# Altium schematic sheet PWR_LDOs.SchDoc: Power LDOs
size 420 x 297 mm; Author: P. Zdunek; DrawnBy: P. Zdunek; DocumentNumber: 31; SheetNumber: 31; SheetTotal: 37; ModifiedBy: -; CheckedDate: -; Title2: Fast Stabilizer; DivGrp: WUT ISE; Designer: G.Kasprowicz
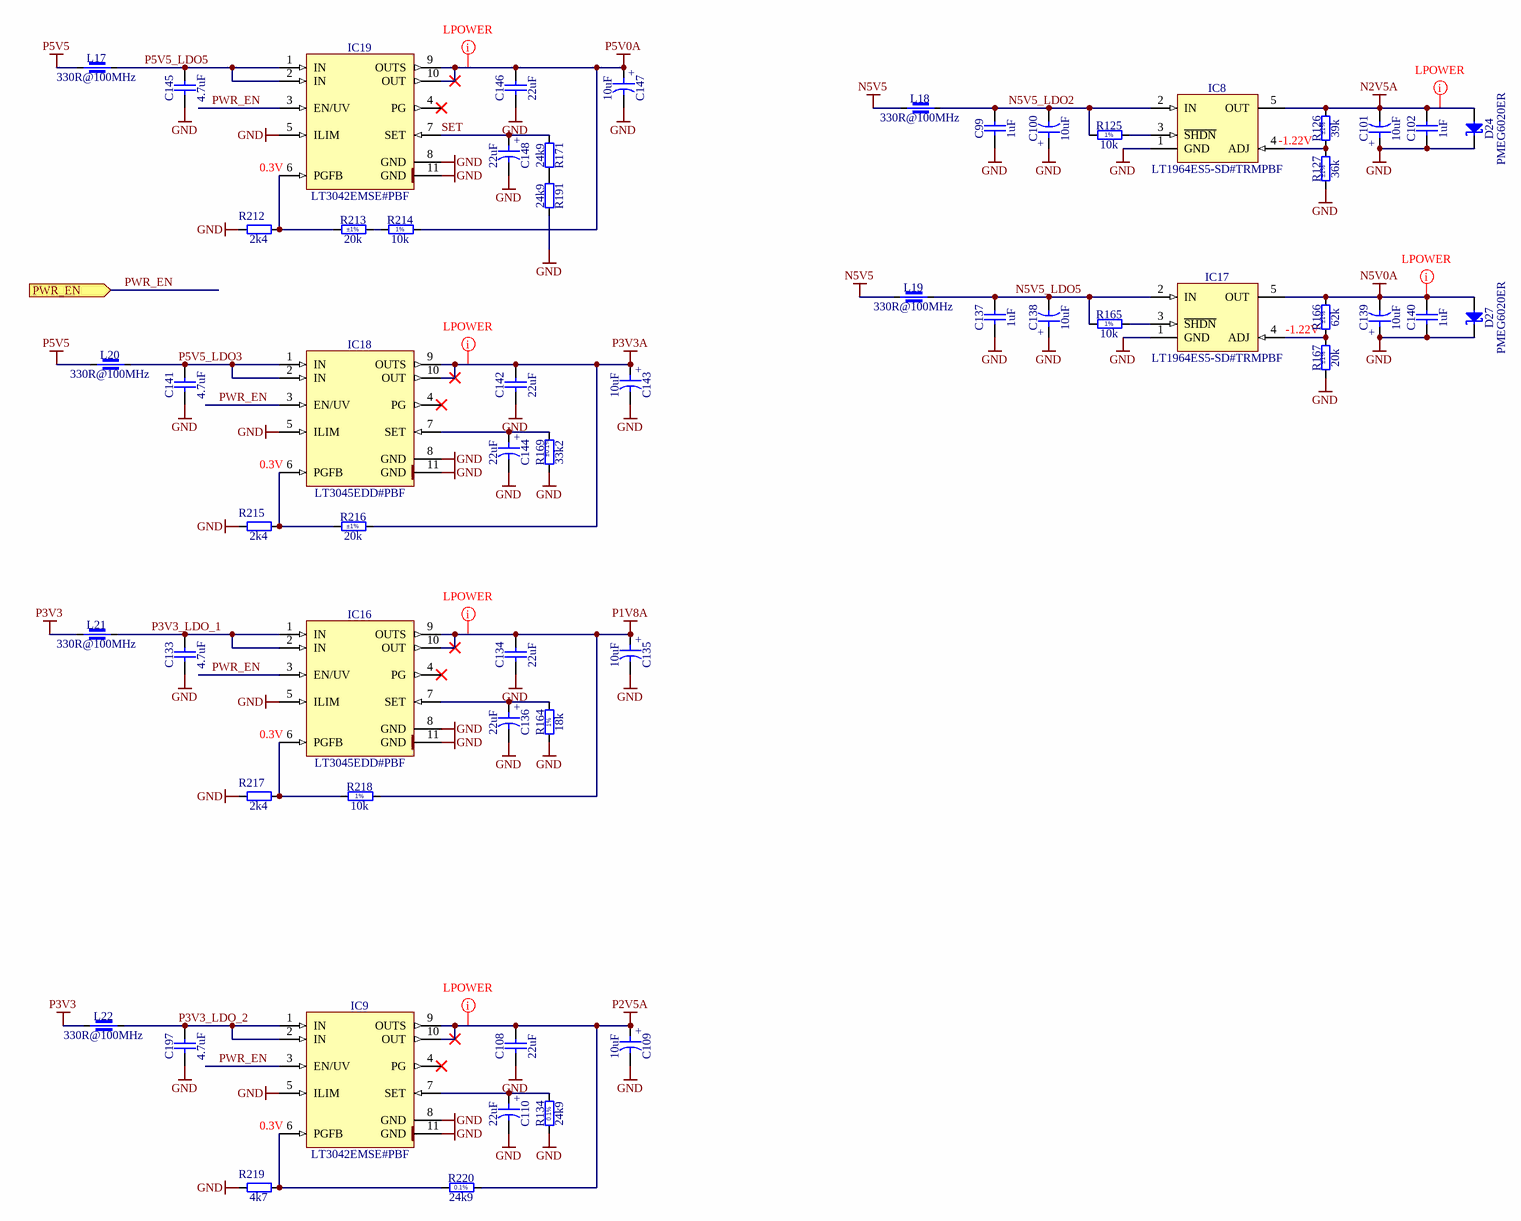
[diagram p0: PWR_LDOs.SchDoc]

## Parts
C99  1uF  [CAPC1005X55N]
C100  10uF  [CAPMP3216X180N]
C101  10uF  [CAPMP3216X180N]
C102  1uF  [CAPC1005X55N]
C108  22uF  [CAPC2012X135N]
C109  10uF  [CAPMP3216X180N]
C110  22uF  [CAPMP3216X180N]
C133  4.7uF  [CAPC1709X95N]
C134  22uF  [CAPC2012X135N]
C135  10uF  [CAPMP3216X180N]
C136  22uF  [CAPMP3216X180N]
C137  1uF  [CAPC1005X55N]
C138  10uF  [CAPMP3216X180N]
C139  10uF  [CAPMP3216X180N]
C140  1uF  [CAPC1005X55N]
C141  4.7uF  [CAPC1709X95N]
C142  22uF  [CAPC2012X135N]
C143  10uF  [CAPMP3216X180N]
C144  22uF  [CAPMP3216X180N]
C145  4.7uF  [CAPC1709X95N]
C146  22uF  [CAPC2012X135N]
C147  10uF  [CAPMP3216X180N]
C148  22uF  [CAPMP3216X180N]
C197  4.7uF  [CAPC1709X95N]
D24  PMEG6020ER  [SODFL3517X110N]
D27  PMEG6020ER  [SODFL3517X110N]
IC8  LT1964ES5-SD#TRMPBF  [SOT95P280X100-5N]
IC9  LT3042EMSE#PBF  [SOP50P490X110-11N-R168X198]
IC16  LT3045EDD#PBF  [SON50P300X300X80-11N-R175X248]
IC17  LT1964ES5-SD#TRMPBF  [SOT95P280X100-5N]
IC18  LT3045EDD#PBF  [SON50P300X300X80-11N-R175X248]
IC19  LT3042EMSE#PBF  [SOP50P490X110-11N-R168X198]
L17  330R@100MHz  [INDC1608X75N]
L18  330R@100MHz  [INDC1608X75N]
L19  330R@100MHz  [INDC1608X75N]
L20  330R@100MHz  [INDC1608X75N]
L21  330R@100MHz  [INDC1608X75N]
L22  330R@100MHz  [INDC1608X75N]
R125  10k  [RESC1005X40N]
R126  39k  Tolerance: ±1%  [RESC1005X40N]
R127  36k  Tolerance: ±1%  [RESC1005X40N]
R134  24k9  [RESC1608X55N]
R164  18k  [RESC1608X55N]
R165  10k  [RESC1005X40N]
R166  62k  Tolerance: ±1%  [RESC1005X40N]
R167  20k  Tolerance: ±1%  [RESC1005X40N]
R169  33k2  Tolerance: ±0.1%  [RESC1608X55N]
R171  24k9  [RESC1608X55N]
R191  24k9  [RESC1608X55N]
R212  2k4  [RESC1005X40N]
R213  20k  Tolerance: ±1%  [RESC1005X40N]
R214  10k  [RESC1005X40N]
R215  2k4  [RESC1005X40N]
R216  20k  Tolerance: ±1%  [RESC1005X40N]
R217  2k4  [RESC1005X40N]
R218  10k  [RESC1005X40N]
R219  4k7  [RESC1005X40N]
R220  24k9  [RESC1608X55N]

## Ports
PWR_EN (in)

## Nets
GND: C99.1 C100.1 C101.1 C102.1 C108.1 C109.2 C110.2 C133.1 C134.1 C135.2 C136.2 C137.1 C138.1 C139.1 C140.1 C141.1 C142.1 C143.2 C144.2 C145.1 C146.1 C147.2 C148.2 C197.1 D24.1(C) D27.1(C) IC8.1(GND) IC9.5(ILIM) IC9.8(GND) IC9.11(GND) IC16.5(ILIM) IC16.8(GND) IC16.11(GND) IC17.1(GND) IC18.5(ILIM) IC18.8(GND) IC18.11(GND) IC19.5(ILIM) IC19.8(GND) IC19.11(GND) R127.1 R134.1 R164.1 R167.1 R169.1 R191.2 R212.1 R215.1 R217.1 R219.1
N2V5A: C101.2 C102.2 D24.2(A) IC8.5(OUT) R126.2
N5V0A: C139.2 C140.2 D27.2(A) IC17.5(OUT) R166.2
N5V5: L18.1 L19.1
P1V8A: C134.2 C135.1 IC16.9(OUTS) IC16.10(OUT) R218.2
P2V5A: C108.2 C109.1 IC9.9(OUTS) IC9.10(OUT) R220.2
P3V3: L21.1 L22.1
P3V3A: C142.2 C143.1 IC18.9(OUTS) IC18.10(OUT) R216.2
P5V0A: C146.2 C147.1 IC19.9(OUTS) IC19.10(OUT) R214.2
P5V5: L17.1 L20.1
N5V5_LDO2: C99.2 C100.2 IC8.2(IN) L18.2 R125.1
N5V5_LDO5: C137.2 C138.2 IC17.2(IN) L19.2 R165.1
P3V3_LDO_1: C133.2 IC16.1(IN) IC16.2(IN) L21.2
P3V3_LDO_2: C197.2 IC9.1(IN) IC9.2(IN) L22.2
P5V5_LDO3: C141.2 IC18.1(IN) IC18.2(IN) L20.2
P5V5_LDO5: C145.2 IC19.1(IN) IC19.2(IN) L17.2
PWR_EN: IC9.3(EN/UV) IC16.3(EN/UV) IC18.3(EN/UV) IC19.3(EN/UV) ; port PWR_EN
SET: C148.1 IC19.7(SET) R171.1
NetC110_1: C110.1 IC9.7(SET) R134.2
NetC136_1: C136.1 IC16.7(SET) R164.2
NetC144_1: C144.1 IC18.7(SET) R169.2
NetIC8_3: IC8.3(~{SHDN}) R125.2
NetIC8_4: IC8.4(ADJ) R126.1 R127.2
NetIC9_6: IC9.6(PGFB) R219.2 R220.1
NetIC16_6: IC16.6(PGFB) R217.2 R218.1
NetIC17_3: IC17.3(~{SHDN}) R165.2
NetIC17_4: IC17.4(ADJ) R166.1 R167.2
NetIC18_6: IC18.6(PGFB) R215.2 R216.1
NetIC19_6: IC19.6(PGFB) R212.2 R213.1
NetR171_2: R171.2 R191.1
NetR213_2: R213.2 R214.1

Not connected (* = marked no-connect by the designer): IC9 4(PG)*; IC16 4(PG)*; IC18 4(PG)*; IC19 4(PG)*

## Layout directives
net class Lpower: N2V5A, N5V0A, P1V8A, P2V5A, P3V3A, P5V0A

## Notes on the sheet
- -1.22V
- (near IC19) 0.3V
- (near IC18) 0.3V
- (near IC16) 0.3V
- (near IC9) 0.3V
- Project/Equipment
- Document
- Designer
- Drawn by
- Check.by
- Copyright WUT ISE 2020.
  This documentation describes Open Hardware and is licensed under the CERN OHL v.1.2. You may redistribute and modify this documentation under the terms of the CERN OHL v.1.2. (http://ohwr.org/CERNOHL). This documentation is distributed WITHOUT ANY EXPRESS OR IMPLIED WARRANTY, INCLUDING OF MERCHANTABILITY, SATISFACTORY QUALITY AND FITNESS FOR A PARTICULAR PURPOSE. Please see the CERN OHL v.1.2 for applicable conditions.
- Contact
- File
- Last Mod.
- Print Date
- Sheet
- Size
- A3
- of
- Rev
- (in symbol CTE3216-18_10UF_16V_20%_AVX_TCJ) +
- (in symbol CTE3216-18_22UF_10V_10%) +
- (in symbol R0402_10K_1%_0.0625W_100PPM) 1%
- (in symbol R0603_18K_1%_0.1W_100PPM) 1%
- (in symbol R0603_24K9_0.1%_0.063W_10PPM) 0.1%

## Library data of the parts
C99 C102 C137 C140 = CC0402_1UF_16V_10%_X5R: Non-polarised capacitor; Part Description: SMD Multilayer Chip Ceramic Capacitor; Manufacturer: GENERIC; Manufacturer1 Part Number: C1005X5R1C105KT; Voltage: 16V; TC: X5R; Tolerance: ±10%; Part Number: CC0402_1UF_16V_10%_X5R; Component Kind: Standard; Component Type: Standard; Pin Count: 2; Value: 1uF; Status: Preferred; Manufacturer Part Number: CC0402_1UF_16V_10%_X5R; Case: 0402; Mounted: Yes; Socket: No; SMD: Yes; Sense: No; Manufacturer1 Example: TDK; Manufacturer1 ComponentHeight: 0.55mm; HelpURL: \\cern.ch\dfs\Applications\Altium\Datasheets\CC0402_X5R_TDK_C.pdf; Author: CERN DEM JLC; CreateDate: 25/10/2012; LatestRevisionDate: 25/10/2012
C100 C101 C109 C135 C138 C139 C143 C147 = CTE3216-18_10UF_16V_20%_AVX_TCJ: Polarised capacitor; Part Description: ESR 0R200 Tantalum Solid Electrolytic Chip Capacitor with Conductive Polymer Electrode; Manufacturer: AVX; Manufacturer Part Number: TCJA106M016R0200; Voltage: 16V; Tolerance: ±20%; Part Number: CTE3216-18_10UF_16V_20%_AVX_TCJ; Component Kind: Standard; Component Type: Standard; Pin Count: 2; Value: 10uF; Status: Preferred; Case: A; Mounted: Yes; Socket: No; SMD: Yes; Sense: No; ComponentHeight: 1.8mm; HelpURL: \\cern.ch\dfs\Applications\Altium\Datasheets\CTE_AVX_TCJ.pdf; Author: CERN DEM JLC; CreateDate: 29.03.2012; LatestRevisionDate: 29.03.2012
C108 C134 C142 C146 = CC0805_22UF_16V_10%_X5R: Non-polarised capacitor; Part Description: SMD Multilayer Chip Ceramic Capacitor; Manufacturer: GENERIC; Manufacturer1 Part Number: C2012X5R1C226KT; Voltage: 16V; TC: X5R; Tolerance: ±10%; Part Number: CC0805_22UF_16V_10%_X5R; Component Kind: Standard; Component Type: Standard; Pin Count: 2; Value: 22uF; Status: Preferred; Manufacturer Part Number: CC0805_22UF_16V_10%_X5R; Case: 0805; Mounted: Yes; Socket: No; SMD: Yes; Sense: No; Manufacturer1 Example: TDK; Manufacturer1 ComponentHeight: 1.35mm; HelpURL: \\cern.ch\dfs\Applications\Altium\Datasheets\CC0805_X5R_TDK_C.pdf; Author: CERN DEM JLC; CreateDate: 25.10.2012; LatestRevisionDate: 25.10.2012
C110 C136 C144 C148 = CTE3216-18_22UF_10V_10%: Polarised capacitor; Part Description: Solid Tantalum Chip Capacitor; Manufacturer: GENERIC; Manufacturer1 Part Number: TAJA226K010R; Voltage: 10V; Tolerance: ±10%; Part Number: CTE3216-18_22UF_10V_10%; Component Kind: Standard; Component Type: Standard; Pin Count: 2; Value: 22uF; Status: Preferred; Manufacturer Part Number: CTE3216-18_22UF_10V_10%; Case: A; Mounted: Yes; Socket: No; SMD: Yes; Sense: No; Manufacturer1 Example: AVX; Manufacturer1 ComponentHeight: 1.8mm; HelpURL: \\cern.ch\dfs\Applications\Altium\Datasheets\CTE_AVX_TAJ.pdf; Author: CERN DEM JLC; CreateDate: 03/12/2007; LatestRevisionDate: 03/12/2007
C133 C141 C145 C197 = CC0603_4.7UF_16V_10%_X5R: Non-polarised capacitor; Part Description: SMD Multilayer Chip Ceramic Capacitor; Manufacturer: GENERIC; Manufacturer1 Part Number: EMK107ABJ475KA-T; Voltage: 16V; TC: X5R; Tolerance: ±10%; Part Number: CC0603_4.7UF_16V_10%_X5R; Component Kind: Standard; Component Type: Standard; Pin Count: 2; Value: 4.7uF; Status: None; Manufacturer Part Number: CC0603_4.7UF_16V_10%_X5R; Case: 0603; Mounted: Yes; Socket: No; SMD: Yes; Sense: No; Manufacturer1 Example: TAIYO YUDEN; Manufacturer1 ComponentHeight: 0.95mm; HelpURL: \\cern.ch\dfs\Applications\Altium\Datasheets\CC0603_X7R_TAIYO-YUDEN_HIGH-VALUE.pdf; Author: CERN DEM JLC; CreateDate: 16-Dec-13; LatestRevisionDate: 16-Sep-14
D24 D27 = PMEG6020ER: Schottky Diode; Part Description: MEGA Schottky Barrier Rectifier; Manufacturer: NXP SEMICONDUCTORS; Voltage: 60V; Power: 2A; PressFit: No; Bonding: No; Part Number: PMEG6020ER; Component Kind: Standard; Component Type: Standard; Device: PMEG6020ER; PackageDescription: SODFL Diode (SOD123W); 2.60mm W X 1.70mm L X 1.10mm H body, IPC Medium Density; Manufacturer Part Number: PMEG6020ER; Pin Count: 2; Case: SOD-123FL; Mounted: Yes; Socket: No; SMD: Yes; Sense: No; ComponentHeight: 1.1mm; HelpURL: \\cern.ch\dfs\Applications\Altium\Datasheets\PMEG6020ER.pdf; Author: CERN DEM JMW; CreateDate: 19.06.2014; LatestRevisionDate: 19.06.2014
IC8 IC17 = LT1964ES5-SD#TRMPBF: 200mA, Low Noise, Low Dropout Negative Micropower Regulator; Part Description: -1.22V to -20V, 200mA, Low Noise, Low Dropout Negative Micropower Regulator; Manufacturer: LINEAR TECHNOLOGY; PressFit: No; Bonding: No; Part Number: LT1964ES5-SD#TRMPBF; Component Kind: Standard; Component Type: Standard; Device: LT1964ES5-SD#TRMPBF; PackageDescription: SOT23, 0.95mm pitch; 5 pin, 1.75mm W X 3.00mm L, IPC Medium Density; Manufacturer Part Number: LT1964ES5-SD#TRMPBF; Pin Count: 5; Case: SOT23-5; Mounted: Yes; Socket: No; SMD: Yes; Sense: No; ComponentHeight: 1mm; HelpURL: \\cern.ch\dfs\Applications\Altium\Datasheets\LT1964ES5-SD#TRMPBF.pdf; Author: CERN DEM JLC; CreateDate: 05.05.2009; LatestRevisionDate: 05.05.2009
IC9 IC19 = LT3042EMSE#PBF: 20V, 200mA, Ultralow Noise, Ultrahigh PSRR RF Linear Regulator; Manufacturer: LINEAR TECHNOLOGY; PressFit: No; Bonding: No; Part Number: LT3042EMSE#PBF; Component Kind: Standard; Component Type: Standard; Device: LT3042EMSE#PBF; PackageDescription: SOP, 0.50mm, Pitch; 10 pin, 3.00mm W X 3.00mm L X 1.10mm H body (w/thermal tab  1.68 X 1.98 mm), IPC Medium Density; Part Description: 20V, 200mA, Ultralow Noise, Ultrahigh PSRR RF Linear Regulator; Manufacturer Part Number: LT3042EMSE#PBF; Pin Count: 11; Case: MSOP10; Mounted: Yes; Socket: No; SMD: Yes; Sense: No; ComponentHeight: 1.1mm; HelpURL: \\cern.ch\dfs\Applications\Altium\Datasheets\LT3042EMSE#PBF.pdf; Author: CERN DEM MR; CreateDate: 09.06.2016; LatestRevisionDate: 09.06.2016
IC16 IC18 = LT3045EDD#PBF: 20V, 500mA, Ultralow Noise, Ultrahigh PSRR Linear Regulator; Manufacturer: LINEAR TECHNOLOGY; PressFit: No; Bonding: No; Part Number: LT3045EDD#PBF; Component Kind: Standard; Component Type: Standard; Device: LT3045EDD#PBF; PackageDescription: SON, 0.50mm Pitch; 10 Pin, 3.00mm W X 3.00mm L X 0.80mm H body (w/Thermal Tab 1.75 X 2.48 mm), IPC Medium Density; Part Description: 20V, 500mA, Ultralow Noise, Ultrahigh PSRR Linear Regulator; Manufacturer Part Number: LT3045EDD#PBF; Pin Count: 11; Case: SON10; Mounted: Yes; Socket: No; SMD: Yes; Sense: No; ComponentHeight: 0.8mm; HelpURL: \\cern.ch\dfs\Applications\Altium\Datasheets\LT3045EDD#PBF.pdf; Author: CERN DEM JLC; CreateDate: 07/12/2016; LatestRevisionDate: 07/12/2016
L17-L22 = IND0603_TDK_MPZ1608S331ATD25: Part Description: SMT Chip Bead for Power Line (For Automotive Grade); Manufacturer: TDK; Power: 1.7A; Resistance: 0.08R; Tolerance: ±25%; Part Number: IND0603_TDK_MPZ1608S331ATD25; Component Kind: Standard; Component Type: Standard; Pin Count: 2; Value: 330R@100MHz; Manufacturer Part Number: MPZ1608S331ATD25; Case: 0603; Mounted: Yes; Socket: No; SMD: Yes; Sense: No; ComponentHeight: 0.8mm; HelpURL: \\cern.ch\dfs\Applications\Altium\Datasheets\IND0603_TDK_MPZ1608_Automotive.pdf; Author: CERN DEM JLC; CreateDate: 10.01.2018; LatestRevisionDate: 25.10.2018
R125 R165 = R0402_10K_1%_0.0625W_100PPM: Resistor - 1%; Part Description: General Purpose Thick Film Chip Resistor; Manufacturer: GENERIC; Manufacturer1 Part Number: 232270671003L; PressFit: No; TC: ±100ppm/°C; Part Number: R0402_10K_1%_0.0625W_100PPM; Component Kind: Standard; Component Type: Standard; Pin Count: 2; Value: 10k; Status: Not Recommended; Manufacturer Part Number: R0402_10K_1%_0.0625W_100PPM; Case: 0402; Mounted: Yes; Sense: No; Socket: No; SMD: Yes; Manufacturer1 Example: YAGEO PHYCOMP; Manufacturer1 ComponentHeight: 0.4mm; HelpURL: \\cern.ch\dfs\Applications\Altium\Datasheets\R0402_Phycomp_RC0402.pdf; Author: CERN DEM JLC; CreateDate: 03-Dec-07; LatestRevisionDate: 17-Oct-12; Power: 0.0625W; Tolerance: ±1%
R126 = R0402_39K_1%_0.0625W_100PPM: Resistor - 1%; Part Description: General Purpose Thick Film Chip Resistor; Manufacturer: GENERIC; Manufacturer1 Part Number: 232270673903; TC: ±100ppm/°C; PressFit: No; Part Number: R0402_39K_1%_0.0625W_100PPM; Component Kind: Standard; Component Type: Standard; Pin Count: 2; Value: 39k; Status: Not Recommended; Power: 0.0625W; Manufacturer Part Number: R0402_39K_1%_0.0625W_100PPM; Case: 0402; Mounted: Yes; Sense: No; Socket: No; SMD: Yes; Manufacturer1 Example: YAGEO PHYCOMP; Manufacturer1 ComponentHeight: 0.4mm; HelpURL: \\cern.ch\dfs\Applications\Altium\Datasheets\R0402_Phycomp_RC0402.pdf; Author: CERN DEM JLC; CreateDate: 03.12.2007; LatestRevisionDate: 17.10.2012
R127 = R0402_36K_1%_0.0625W_100PPM: Resistor - 1%; Part Description: General Purpose Thick Film Chip Resistor; Manufacturer: GENERIC; Manufacturer1 Part Number: 232270673603L; TC: ±100ppm/°C; PressFit: No; Part Number: R0402_36K_1%_0.0625W_100PPM; Component Kind: Standard; Component Type: Standard; Pin Count: 2; Value: 36k; Status: Not Recommended; Power: 0.0625W; Manufacturer Part Number: R0402_36K_1%_0.0625W_100PPM; Case: 0402; Mounted: Yes; Sense: No; Socket: No; SMD: Yes; Manufacturer1 Example: YAGEO PHYCOMP; Manufacturer1 ComponentHeight: 0.4mm; HelpURL: \\cern.ch\dfs\Applications\Altium\Datasheets\R0402_Phycomp_RC0402.pdf; Author: CERN DEM JLC; CreateDate: 03.12.2007; LatestRevisionDate: 17.10.2012
R134 R191 R220 = R0603_24K9_0.1%_0.063W_10PPM: Resistor - 0.1%; Part Description: Thin Film Chip Resistor; Manufacturer: GENERIC; Manufacturer1 Part Number: RN73C1J24K9BTDF; Power: 0.063W; TC: ±10ppm; PressFit: No; Part Number: R0603_24K9_0.1%_0.063W_10PPM; Component Kind: Standard; Component Type: Standard; Pin Count: 2; Value: 24k9; Status: Not Recommended; Tolerance: ±0.1%; Manufacturer Part Number: R0603_24K9_0.1%_0.063W_10PPM; Case: 0603; Mounted: Yes; Sense: No; Socket: No; SMD: Yes; Manufacturer1 Example: TYCO HOLSWORTHY; Manufacturer1 ComponentHeight: 0.5mm; HelpURL: \\cern.ch\dfs\Applications\Altium\Datasheets\R0603_Tyco_RN73.pdf; Author: CERN DEM JLC
  R134 R220: CreateDate: 03-Dec-07; LatestRevisionDate: 13-Mar-08
  R191: CreateDate: 03.12.2007; LatestRevisionDate: 13.03.2008
R164 = R0603_18K_1%_0.1W_100PPM: Resistor - 1%; Part Description: General Purpose Thick Film Chip Resistor; Manufacturer: GENERIC; Manufacturer1 Part Number: NRC06F1802TRF; Power: 0.1W; TC: ±100ppm/°C; PressFit: No; Part Number: R0603_18K_1%_0.1W_100PPM; Component Kind: Standard; Component Type: Standard; Pin Count: 2; Value: 18k; Status: Preferred; Tolerance: ±1%; Manufacturer Part Number: R0603_18K_1%_0.1W_100PPM; Case: 0603; Mounted: Yes; Sense: No; Socket: No; SMD: Yes; Manufacturer1 Example: NIC COMPONENT; Manufacturer1 ComponentHeight: 0.55mm; HelpURL: \\cern.ch\dfs\Applications\Altium\Datasheets\R0603_NIC_NRC.pdf; Author: CERN DEM JLC; CreateDate: 03/12/2007; LatestRevisionDate: 13/03/2008
R166 = R0402_62K_1%_0.0625W_100PPM: Resistor - 1%; Part Description: General Purpose Thick Film Chip Resistor; Manufacturer: GENERIC; Manufacturer1 Part Number: 232270676203L; TC: ±100ppm/°C; PressFit: No; Part Number: R0402_62K_1%_0.0625W_100PPM; Component Kind: Standard; Component Type: Standard; Pin Count: 2; Value: 62k; Status: Not Recommended; Power: 0.0625W; Manufacturer Part Number: R0402_62K_1%_0.0625W_100PPM; Case: 0402; Mounted: Yes; Sense: No; Socket: No; SMD: Yes; Manufacturer1 Example: YAGEO PHYCOMP; Manufacturer1 ComponentHeight: 0.4mm; HelpURL: \\cern.ch\dfs\Applications\Altium\Datasheets\R0402_Phycomp_RC0402.pdf; Author: CERN DEM JLC; CreateDate: 03.12.2007; LatestRevisionDate: 17.10.2012
R167 R213 R216 = R0402_20K_1%_0.0625W_100PPM: Resistor - 1%; Part Description: General Purpose Thick Film Chip Resistor; Manufacturer: GENERIC; Manufacturer1 Part Number: 232270672003L; TC: ±100ppm/°C; PressFit: No; Part Number: R0402_20K_1%_0.0625W_100PPM; Component Kind: Standard; Component Type: Standard; Pin Count: 2; Value: 20k; Status: Not Recommended; Power: 0.0625W; Manufacturer Part Number: R0402_20K_1%_0.0625W_100PPM; Case: 0402; Mounted: Yes; Sense: No; Socket: No; SMD: Yes; Manufacturer1 Example: YAGEO PHYCOMP; Manufacturer1 ComponentHeight: 0.4mm; HelpURL: \\cern.ch\dfs\Applications\Altium\Datasheets\R0402_Phycomp_RC0402.pdf; Author: CERN DEM JLC; CreateDate: 03.12.2007; LatestRevisionDate: 17.10.2012
R169 = R0603_33K2_0.1%_0.063W_10PPM: Resistor - 0.1%; Part Description: Thin Film Chip Resistor; Manufacturer: GENERIC; Manufacturer1 Part Number: RN73C1J33K2BTDF; Power: 0.063W; TC: ±10ppm; PressFit: No; Part Number: R0603_33K2_0.1%_0.063W_10PPM; Component Kind: Standard; Component Type: Standard; Pin Count: 2; Value: 33k2; Status: Not Recommended; Manufacturer Part Number: R0603_33K2_0.1%_0.063W_10PPM; Case: 0603; Mounted: Yes; Sense: No; Socket: No; SMD: Yes; Manufacturer1 Example: TYCO HOLSWORTHY; Manufacturer1 ComponentHeight: 0.5mm; HelpURL: \\cern.ch\dfs\Applications\Altium\Datasheets\R0603_Tyco_RN73.pdf; Author: CERN DEM JLC; CreateDate: 03.12.2007; LatestRevisionDate: 13.03.2008
R171 = R0603_24K9_0.1%_0.063W_10PPM: Resistor - 0.1%; Part Description: Thin Film Chip Resistor; Manufacturer: GENERIC; Manufacturer1 Part Number: RN73C1J24K9BTDF; PressFit: No; Power: 0.063W; TC: ±10ppm; Part Number: R0603_24K9_0.1%_0.063W_10PPM; Component Kind: Standard; Component Type: Standard; Pin Count: 2; Value: 24k9; Status: Not Recommended; Manufacturer Part Number: R0603_24K9_0.1%_0.063W_10PPM; Case: 0603; Mounted: Yes; Sense: No; Socket: No; SMD: Yes; Manufacturer1 Example: TYCO HOLSWORTHY; Manufacturer1 ComponentHeight: 0.5mm; HelpURL: \\cern.ch\dfs\Applications\Altium\Datasheets\R0603_Tyco_RN73.pdf; Author: CERN DEM JLC; CreateDate: 03.12.2007; LatestRevisionDate: 13.03.2008; Tolerance: ±0.1%
R212 R215 R217 = R0402_2K4_1%_0.0625W_100PPM: Resistor - 1%; Part Description: General Purpose Thick Film Chip Resistor; Manufacturer: GENERIC; Manufacturer1 Part Number: 232270672402L; TC: ±100ppm/°C; PressFit: No; Part Number: R0402_2K4_1%_0.0625W_100PPM; Component Kind: Standard; Component Type: Standard; Pin Count: 2; Value: 2k4; Status: Not Recommended; Power: 0.0625W; Tolerance: ±1%; Manufacturer Part Number: R0402_2K4_1%_0.0625W_100PPM; Case: 0402; Mounted: Yes; Sense: No; Socket: No; SMD: Yes; Manufacturer1 Example: YAGEO PHYCOMP; Manufacturer1 ComponentHeight: 0.4mm; HelpURL: \\cern.ch\dfs\Applications\Altium\Datasheets\R0402_Phycomp_RC0402.pdf; Author: CERN DEM JLC; CreateDate: 03.12.2007; LatestRevisionDate: 17.10.2012
R214 R218 = R0402_10K_1%_0.0625W_100PPM: Resistor - 1%; Part Description: General Purpose Thick Film Chip Resistor; Manufacturer: GENERIC; Manufacturer1 Part Number: 232270671003L; TC: ±100ppm/°C; PressFit: No; Part Number: R0402_10K_1%_0.0625W_100PPM; Component Kind: Standard; Component Type: Standard; Pin Count: 2; Value: 10k; Status: Not Recommended; Power: 0.0625W; Tolerance: ±1%; Manufacturer Part Number: R0402_10K_1%_0.0625W_100PPM; Case: 0402; Mounted: Yes; Sense: No; Socket: No; SMD: Yes; Manufacturer1 Example: YAGEO PHYCOMP; Manufacturer1 ComponentHeight: 0.4mm; HelpURL: \\cern.ch\dfs\Applications\Altium\Datasheets\R0402_Phycomp_RC0402.pdf; Author: CERN DEM JLC; CreateDate: 03.12.2007; LatestRevisionDate: 17.10.2012
R219 = R0402_4K7_1%_0.0625W_100PPM: Resistor - 1%; Part Description: General Purpose Thick Film Chip Resistor; Manufacturer: GENERIC; Manufacturer1 Part Number: 232270674702L; TC: ±100ppm/°C; PressFit: No; Part Number: R0402_4K7_1%_0.0625W_100PPM; Component Kind: Standard; Component Type: Standard; Pin Count: 2; Value: 4k7; Status: Not Recommended; Power: 0.0625W; Tolerance: ±1%; Manufacturer Part Number: R0402_4K7_1%_0.0625W_100PPM; Case: 0402; Mounted: Yes; Sense: No; Socket: No; SMD: Yes; Manufacturer1 Example: YAGEO PHYCOMP; Manufacturer1 ComponentHeight: 0.4mm; HelpURL: \\cern.ch\dfs\Applications\Altium\Datasheets\R0402_Phycomp_RC0402.pdf; Author: CERN DEM JLC; CreateDate: 03.12.2007; LatestRevisionDate: 17.10.2012